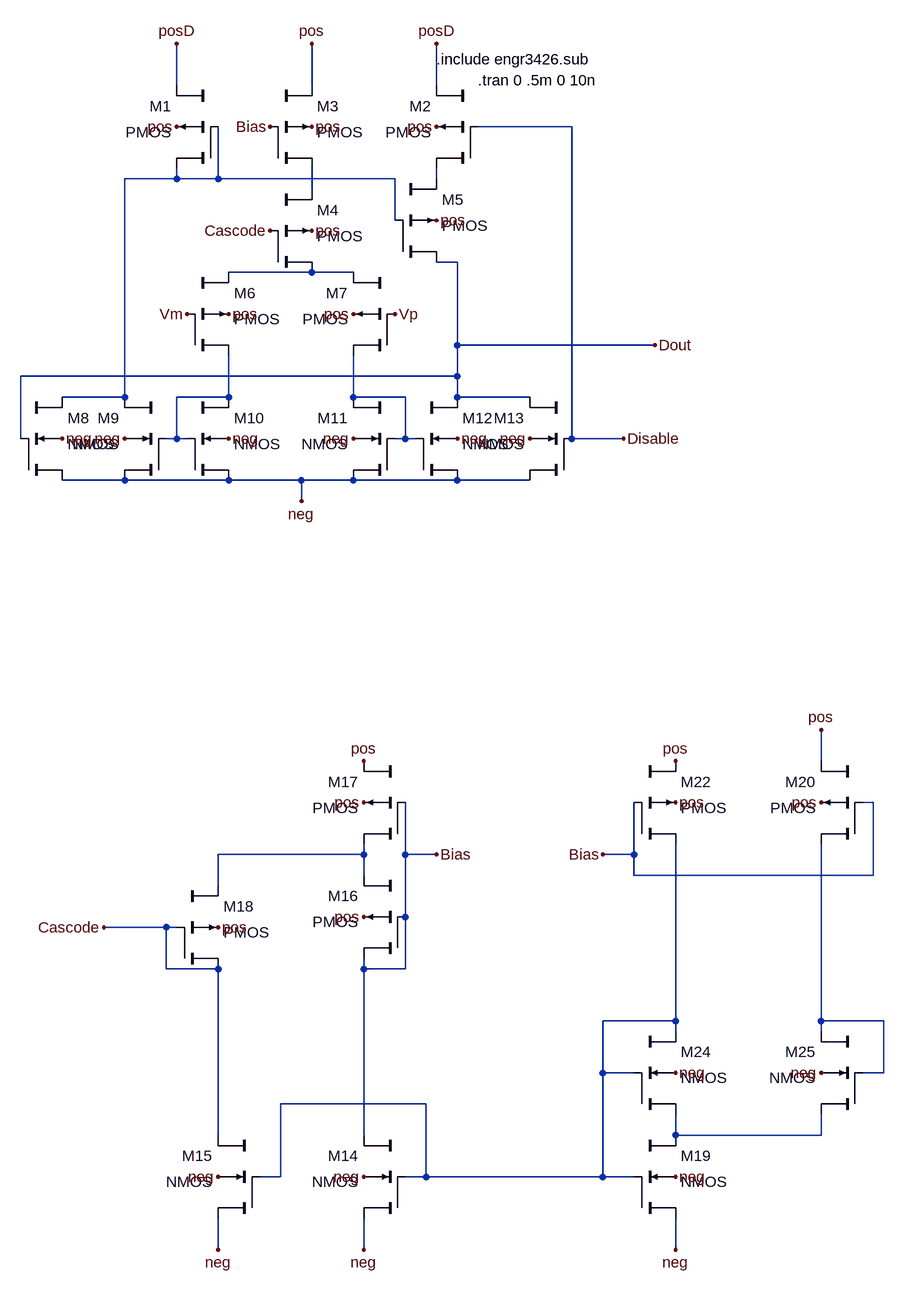
[diagram p0: schematic comparator_gainlatch_AmySym.asc]
comparator_gainlatch_AmySym.asc, the LTspice schematic file:
Version 4
SHEET 1 1328 1948
WIRE 32 48 32 -16
WIRE 240 48 240 -16
WIRE 432 48 432 -16
WIRE 640 112 496 112
WIRE 32 192 32 176
WIRE 32 192 -48 192
WIRE 96 192 96 112
WIRE 96 192 32 192
WIRE 368 192 96 192
WIRE 432 192 432 176
WIRE 240 208 240 176
WIRE 368 256 368 192
WIRE 464 320 432 320
WIRE 240 336 112 336
WIRE 304 336 240 336
WIRE 464 448 464 320
WIRE 768 448 464 448
WIRE 464 496 464 448
WIRE 464 496 -208 496
WIRE -48 528 -48 192
WIRE -48 528 -144 528
WIRE 112 528 112 464
WIRE 112 528 32 528
WIRE 304 528 304 464
WIRE 384 528 304 528
WIRE 464 528 464 496
WIRE 576 528 464 528
WIRE -208 592 -208 496
WIRE 32 592 32 528
WIRE 32 592 16 592
WIRE 48 592 32 592
WIRE 384 592 384 528
WIRE 384 592 368 592
WIRE 400 592 384 592
WIRE 640 592 640 112
WIRE 720 592 640 592
WIRE -48 656 -144 656
WIRE 112 656 -48 656
WIRE 224 656 112 656
WIRE 304 656 224 656
WIRE 464 656 304 656
WIRE 576 656 464 656
WIRE 224 688 224 656
WIRE 1024 1088 1024 1040
WIRE 1104 1152 1088 1152
WIRE 320 1232 320 1216
WIRE 320 1232 96 1232
WIRE 384 1232 384 1152
WIRE 432 1232 384 1232
WIRE 736 1232 736 1152
WIRE 736 1232 688 1232
WIRE 320 1264 320 1232
WIRE 736 1264 736 1232
WIRE 1104 1264 1104 1152
WIRE 1104 1264 736 1264
WIRE 96 1280 96 1232
WIRE 384 1328 384 1232
WIRE 16 1344 -80 1344
WIRE 32 1344 16 1344
WIRE 16 1408 16 1344
WIRE 96 1408 16 1408
WIRE 320 1408 320 1392
WIRE 384 1408 384 1328
WIRE 384 1408 320 1408
WIRE 800 1488 800 1216
WIRE 800 1488 688 1488
WIRE 1024 1488 1024 1216
WIRE 1120 1488 1024 1488
WIRE 800 1504 800 1488
WIRE 1024 1504 1024 1488
WIRE 688 1568 688 1488
WIRE 736 1568 688 1568
WIRE 1120 1568 1120 1488
WIRE 1120 1568 1088 1568
WIRE 416 1616 192 1616
WIRE 96 1664 96 1408
WIRE 320 1664 320 1408
WIRE 800 1664 800 1632
WIRE 1024 1664 1024 1632
WIRE 1024 1664 800 1664
WIRE 192 1728 192 1616
WIRE 192 1728 160 1728
WIRE 416 1728 416 1616
WIRE 416 1728 384 1728
WIRE 688 1728 688 1568
WIRE 688 1728 416 1728
WIRE 736 1728 688 1728
WIRE 96 1840 96 1792
WIRE 320 1840 320 1792
WIRE 800 1840 800 1792
FLAG 32 112 pos
FLAG 240 112 pos
FLAG 432 112 pos
FLAG 240 272 pos
FLAG 432 256 pos
FLAG 112 400 pos
FLAG 304 400 pos
FLAG -48 592 neg
FLAG -144 592 neg
FLAG 112 592 neg
FLAG 304 592 neg
FLAG 464 592 neg
FLAG 576 592 neg
FLAG 368 400 Vp
FLAG 48 400 Vm
FLAG 224 688 neg
FLAG 720 592 Disable
FLAG 768 448 Dout
FLAG 240 -16 pos
FLAG 176 272 Cascode
FLAG 176 112 Bias
FLAG 320 1728 neg
FLAG 96 1728 neg
FLAG 320 1840 neg
FLAG 96 1840 neg
FLAG 320 1328 pos
FLAG 320 1152 pos
FLAG 320 1088 pos
FLAG 96 1344 pos
FLAG -80 1344 Cascode
FLAG 432 1232 Bias
FLAG 800 1728 neg
FLAG 800 1840 neg
FLAG 800 1152 pos
FLAG 800 1088 pos
FLAG 688 1232 Bias
FLAG 800 1568 neg
FLAG 1024 1568 neg
FLAG 1024 1152 pos
FLAG 1024 1040 pos
FLAG 32 -16 posD
FLAG 432 -16 posD
SYMBOL cktsym\\pmos4 32 112 M0
SYMATTR InstName M1
SYMATTR Value2 l=9u w=2.7u
SYMBOL cktsym\\pmos4 240 112 R0
SYMATTR InstName M3
SYMATTR Value2 l=18u w=18u
SYMBOL cktsym\\pmos4 432 112 M0
SYMATTR InstName M2
SYMATTR Value2 l=9u w=2.7u
SYMBOL cktsym\\pmos4 240 272 R0
SYMATTR InstName M4
SYMATTR Value2 l=4.5u w=4.5u
SYMBOL cktsym\\pmos4 432 256 R0
SYMATTR InstName M5
SYMATTR Value2 l=.6u w=2u
SYMBOL cktsym\\pmos4 112 400 R0
SYMATTR InstName M6
SYMATTR Value2 l=7.2u w=3.6u
SYMBOL cktsym\\pmos4 304 400 M0
SYMATTR InstName M7
SYMATTR Value2 l=7.2u w=3.6u
SYMBOL cktsym\\nmos4 -144 592 R0
SYMATTR InstName M8
SYMATTR Value2 l=7.2u w=1.8u
SYMBOL cktsym\\nmos4 -48 592 M0
SYMATTR InstName M9
SYMATTR Value2 l=4.5u w=2.7u
SYMBOL cktsym\\nmos4 112 592 R0
SYMATTR InstName M10
SYMATTR Value2 l=4.5u w=2.7u
SYMBOL cktsym\\nmos4 304 592 M0
SYMATTR InstName M11
SYMATTR Value2 l=4.5u w=2.7u
SYMBOL cktsym\\nmos4 464 592 R0
SYMATTR InstName M12
SYMATTR Value2 l=4.5u w=2.7u
SYMBOL cktsym\\nmos4 576 592 M0
SYMATTR InstName M13
SYMATTR Value2 l=7.2u w=1.8u
SYMBOL cktsym\\nmos4 320 1728 M0
SYMATTR InstName M14
SYMATTR Value2 l=4u w=0.8u
SYMBOL cktsym\\nmos4 96 1728 M0
SYMATTR InstName M15
SYMATTR Value2 l=4u w=4u
SYMBOL cktsym\\pmos4 320 1328 M0
SYMATTR InstName M16
SYMATTR Value2 l=1.8u w=6.4u
SYMBOL cktsym\\pmos4 320 1152 M0
SYMATTR InstName M17
SYMATTR Value2 l=1.8u w=1.8u
SYMBOL cktsym\\pmos4 96 1344 R0
SYMATTR InstName M18
SYMATTR Value2 l=1.8u w=1.8u
SYMBOL cktsym\\nmos4 800 1728 R0
SYMATTR InstName M19
SYMATTR Value2 l=4u w=4u
SYMBOL cktsym\\pmos4 800 1152 R0
SYMATTR InstName M22
SYMATTR Value2 l=1.8u w=0.36u
SYMBOL cktsym\\nmos4 800 1568 R0
SYMATTR InstName M24
SYMATTR Value2 l=4u w=16u
SYMBOL cktsym\\nmos4 1024 1568 M0
SYMATTR InstName M25
SYMATTR Value2 l=4u w=4u
SYMBOL cktsym\\pmos4 1024 1152 M0
SYMATTR InstName M20
SYMATTR Value2 l=1.8u w=1.8u
TEXT 432 8 Left 2 !.include engr3426.sub
TEXT 496 40 Left 2 !.tran 0 .5m 0 10n

The netlist it stands for:
* comparator_gainlatch_AmySym.asc
M1 N001 N001 posD pos PMOS l=9u w=2.7u
M3 N003 Bias pos pos PMOS l=18u w=18u
M2 N002 Disable posD pos PMOS l=9u w=2.7u
M4 N004 Cascode N003 pos PMOS l=4.5u w=4.5u
M5 Dout N001 N002 pos PMOS l=.6u w=2u
M6 N005 Vm N004 pos PMOS l=7.2u w=3.6u
M7 N006 Vp N004 pos PMOS l=7.2u w=3.6u
M8 N001 Dout neg neg NMOS l=7.2u w=1.8u
M9 N001 N005 neg neg NMOS l=4.5u w=2.7u
M10 N005 N005 neg neg NMOS l=4.5u w=2.7u
M11 N006 N006 neg neg NMOS l=4.5u w=2.7u
M12 Dout N006 neg neg NMOS l=4.5u w=2.7u
M13 Dout Disable neg neg NMOS l=7.2u w=1.8u
M14 Bias N008 neg neg NMOS l=4u w=0.8u
M15 Cascode N008 neg neg NMOS l=4u w=4u
M16 Bias Bias N007 pos PMOS l=1.8u w=6.4u
M17 N007 Bias pos pos PMOS l=1.8u w=1.8u
M18 Cascode Cascode N007 pos PMOS l=1.8u w=1.8u
M19 N010 N008 neg neg NMOS l=4u w=4u
M22 N008 Bias pos pos PMOS l=1.8u w=0.36u
M24 N008 N008 N010 neg NMOS l=4u w=16u
M25 N009 N009 N010 neg NMOS l=4u w=4u
M20 N009 Bias pos pos PMOS l=1.8u w=1.8u
.model NMOS NMOS
.model PMOS PMOS
.lib standard.mos
.include engr3426.sub
.tran 0 .5m 0 10n
.backanno
.end